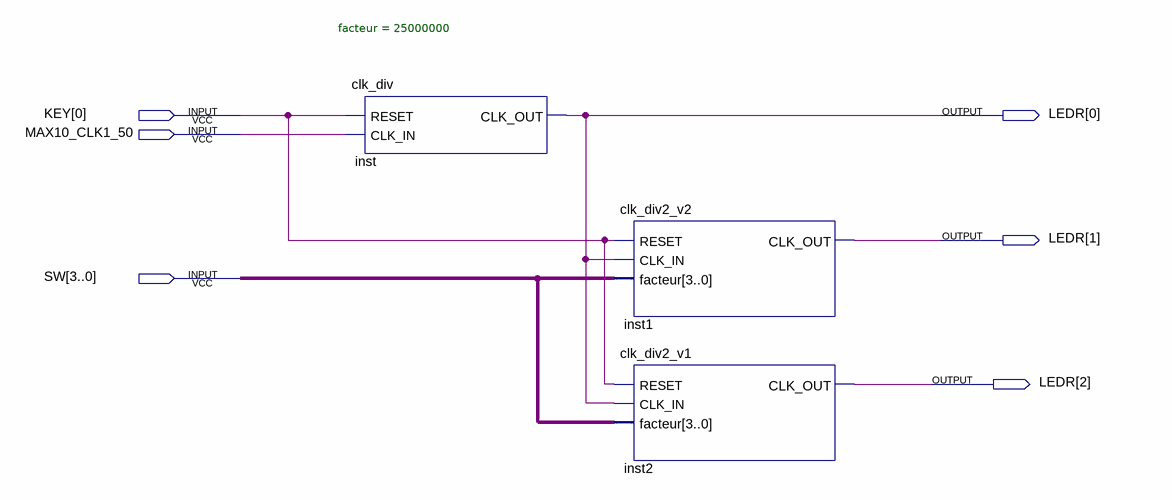
[diagram p0: schematic sheet]
// Quartus schematic clock_divider.bdf as structural Verilog: 3 symbols, 6 pins
module clock_divider (
  input  [0:0] KEY,
  input  MAX10_CLK1_50,
  input  [3:0] SW,
  output [2:0] LEDR
);

  clk_div #(.facteur(25000000)) inst (.RESET(KEY[0]), .CLK_IN(MAX10_CLK1_50), .CLK_OUT(LEDR[0]));
  clk_div2_v2 inst1 (.RESET(KEY[0]), .CLK_IN(LEDR[0]), .facteur(SW), .CLK_OUT(LEDR[1]));
  clk_div2_v1 inst2 (.RESET(KEY[0]), .CLK_IN(LEDR[0]), .facteur(SW), .CLK_OUT(LEDR[2]));
endmodule
